# Altium schematic sheet JTAG_ALTIUM_NANOTALK.SchDoc: NanoTalk JTAG Header
size A4; Organization: Altium Limited.; Address1: Level 3, 12a Rodborough Rd; Address2: Frenchs Forest 2086; Address3: NSW; Address4: AUSTRALIA; Revision: 6; SheetNumber: 22; SheetTotal: 64; PageSetup: Record=PageOptions|CenterHorizontal=True|CenterVertical=True|PrintScale=0.97|XCorrection=1.00|YCorrection=1.00|PrintKind=0|BorderSize=5000000|LeftOffset=0|BottomOffset=0|Orientation=2|PaperLength=1000|PaperWidth=1000|Scale=100|PaperSource=7|PrintQuality=1200|MediaType=1|DitherType=10|PaperKind=A4 (210 x 297 mm)|PrintScaleMode=1
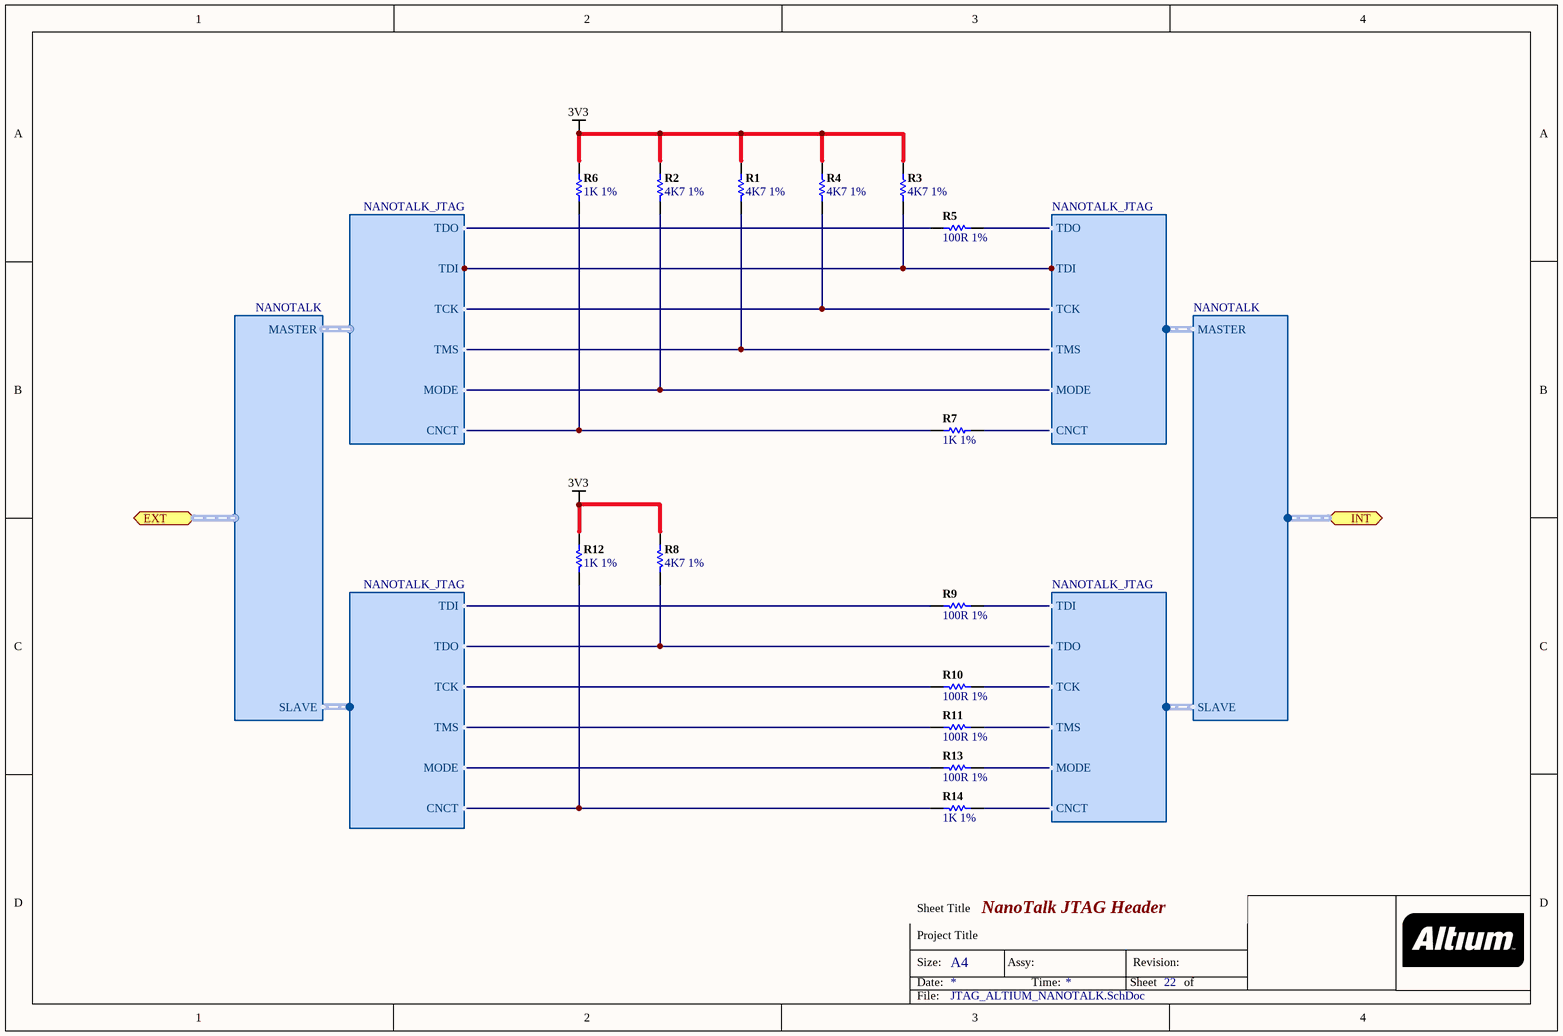
[diagram p0: JTAG_ALTIUM_NANOTALK.SchDoc]

## Parts
R1  4K7 1%  [RESC1005-STAR]
R2  4K7 1%  [RESC1005-STAR]
R3  4K7 1%  [RESC1005-STAR]
R4  4K7 1%  [RESC1005-STAR]
R5  100R 1%  [RESC1005-STAR]
R6  1K 1%  [RESC1005-STAR]
R7  1K 1%  [RESC1005-STAR]
R8  4K7 1%  [RESC1005-STAR]
R9  100R 1%  [RESC1005-STAR]
R10  100R 1%  [RESC1005-STAR]
R11  100R 1%  [RESC1005-STAR]
R12  1K 1%  [RESC1005-STAR]
R13  100R 1%  [RESC1005-STAR]
R14  1K 1%  [RESC1005-STAR]

## Ports
EXT (harness NANOTALK), INT (harness NANOTALK)

## Harnesses
NANOTALK: MASTER, SLAVE
NANOTALK_JTAG: TDI, TCK, TMS, TDO, MODE, CNCT

## Nets
3V3: R1.2 R2.2 R3.2 R4.2 R6.1 R8.1 R12.1
NetR1_1: R1.1 ; harness NANOTALK_JTAG.TMS
NetR2_1: R2.1 ; harness NANOTALK_JTAG.MODE
NetR3_1: R3.1 ; harness NANOTALK_JTAG.TDI
NetR4_1: R4.1 ; harness NANOTALK_JTAG.TCK
NetR5_1: R5.1 ; harness NANOTALK_JTAG.TDO
NetR5_2: R5.2 ; harness NANOTALK_JTAG.TDO
NetR6_2: R6.2 R7.1 ; harness NANOTALK_JTAG.CNCT
NetR7_2: R7.2 ; harness NANOTALK_JTAG.CNCT
NetR8_2: R8.2 ; harness NANOTALK_JTAG.TDO
NetR9_1: R9.1 ; harness NANOTALK_JTAG.TDI
NetR9_2: R9.2 ; harness NANOTALK_JTAG.TDI
NetR10_1: R10.1 ; harness NANOTALK_JTAG.TCK
NetR10_2: R10.2 ; harness NANOTALK_JTAG.TCK
NetR11_1: R11.1 ; harness NANOTALK_JTAG.TMS
NetR11_2: R11.2 ; harness NANOTALK_JTAG.TMS
NetR12_2: R12.2 R14.1 ; harness NANOTALK_JTAG.CNCT
NetR13_1: R13.1 ; harness NANOTALK_JTAG.MODE
NetR13_2: R13.2 ; harness NANOTALK_JTAG.MODE
NetR14_2: R14.2 ; harness NANOTALK_JTAG.CNCT

## Notes on the sheet
- Sheet Title
- Project Title
- Size:
- Date:
- A4
- Assy:
- Time:
- Sheet
- Revision:
- of
- File:

## Library data of the parts
R1-R4 R8 = D-100-0088: Resistor, 4K7 1% 0402 (1005); Power Rating: 63 mW; Resistance: 4.7 K; Category: Resistor; Mounting Technology: Surface Mount; Status: Production; Tolerance: 1 %
R5 R9-R11 R13 = D-100-0131: Resistor, 100R 1% 0402 (1005); Power Rating: 63 mW; Category: Resistor; Mounting Technology: Surface Mount; Resistance: 100 R; Status: Production; Tolerance: 1 %
R6 R7 R12 R14 = D-100-0121: Resistor, 1K 1% 0402 (1005); Power Rating: 63 mW; Category: Resistor; Mounting Technology: Surface Mount; Resistance: 1 K; Status: Production; Tolerance: 1 %